# Altium schematic sheet Power Managemend and Connectors.SchDoc (part 1 of 2)
size A3; SheetNumber: 2; SheetTotal: 3; PageSize: A3; ProjectDescription: Power Managemend and Connectors; preparedBy: Semih AŞÇI; department: HW Design; RelaseDate: 22.12.2021; changedDate: 22.12.2021
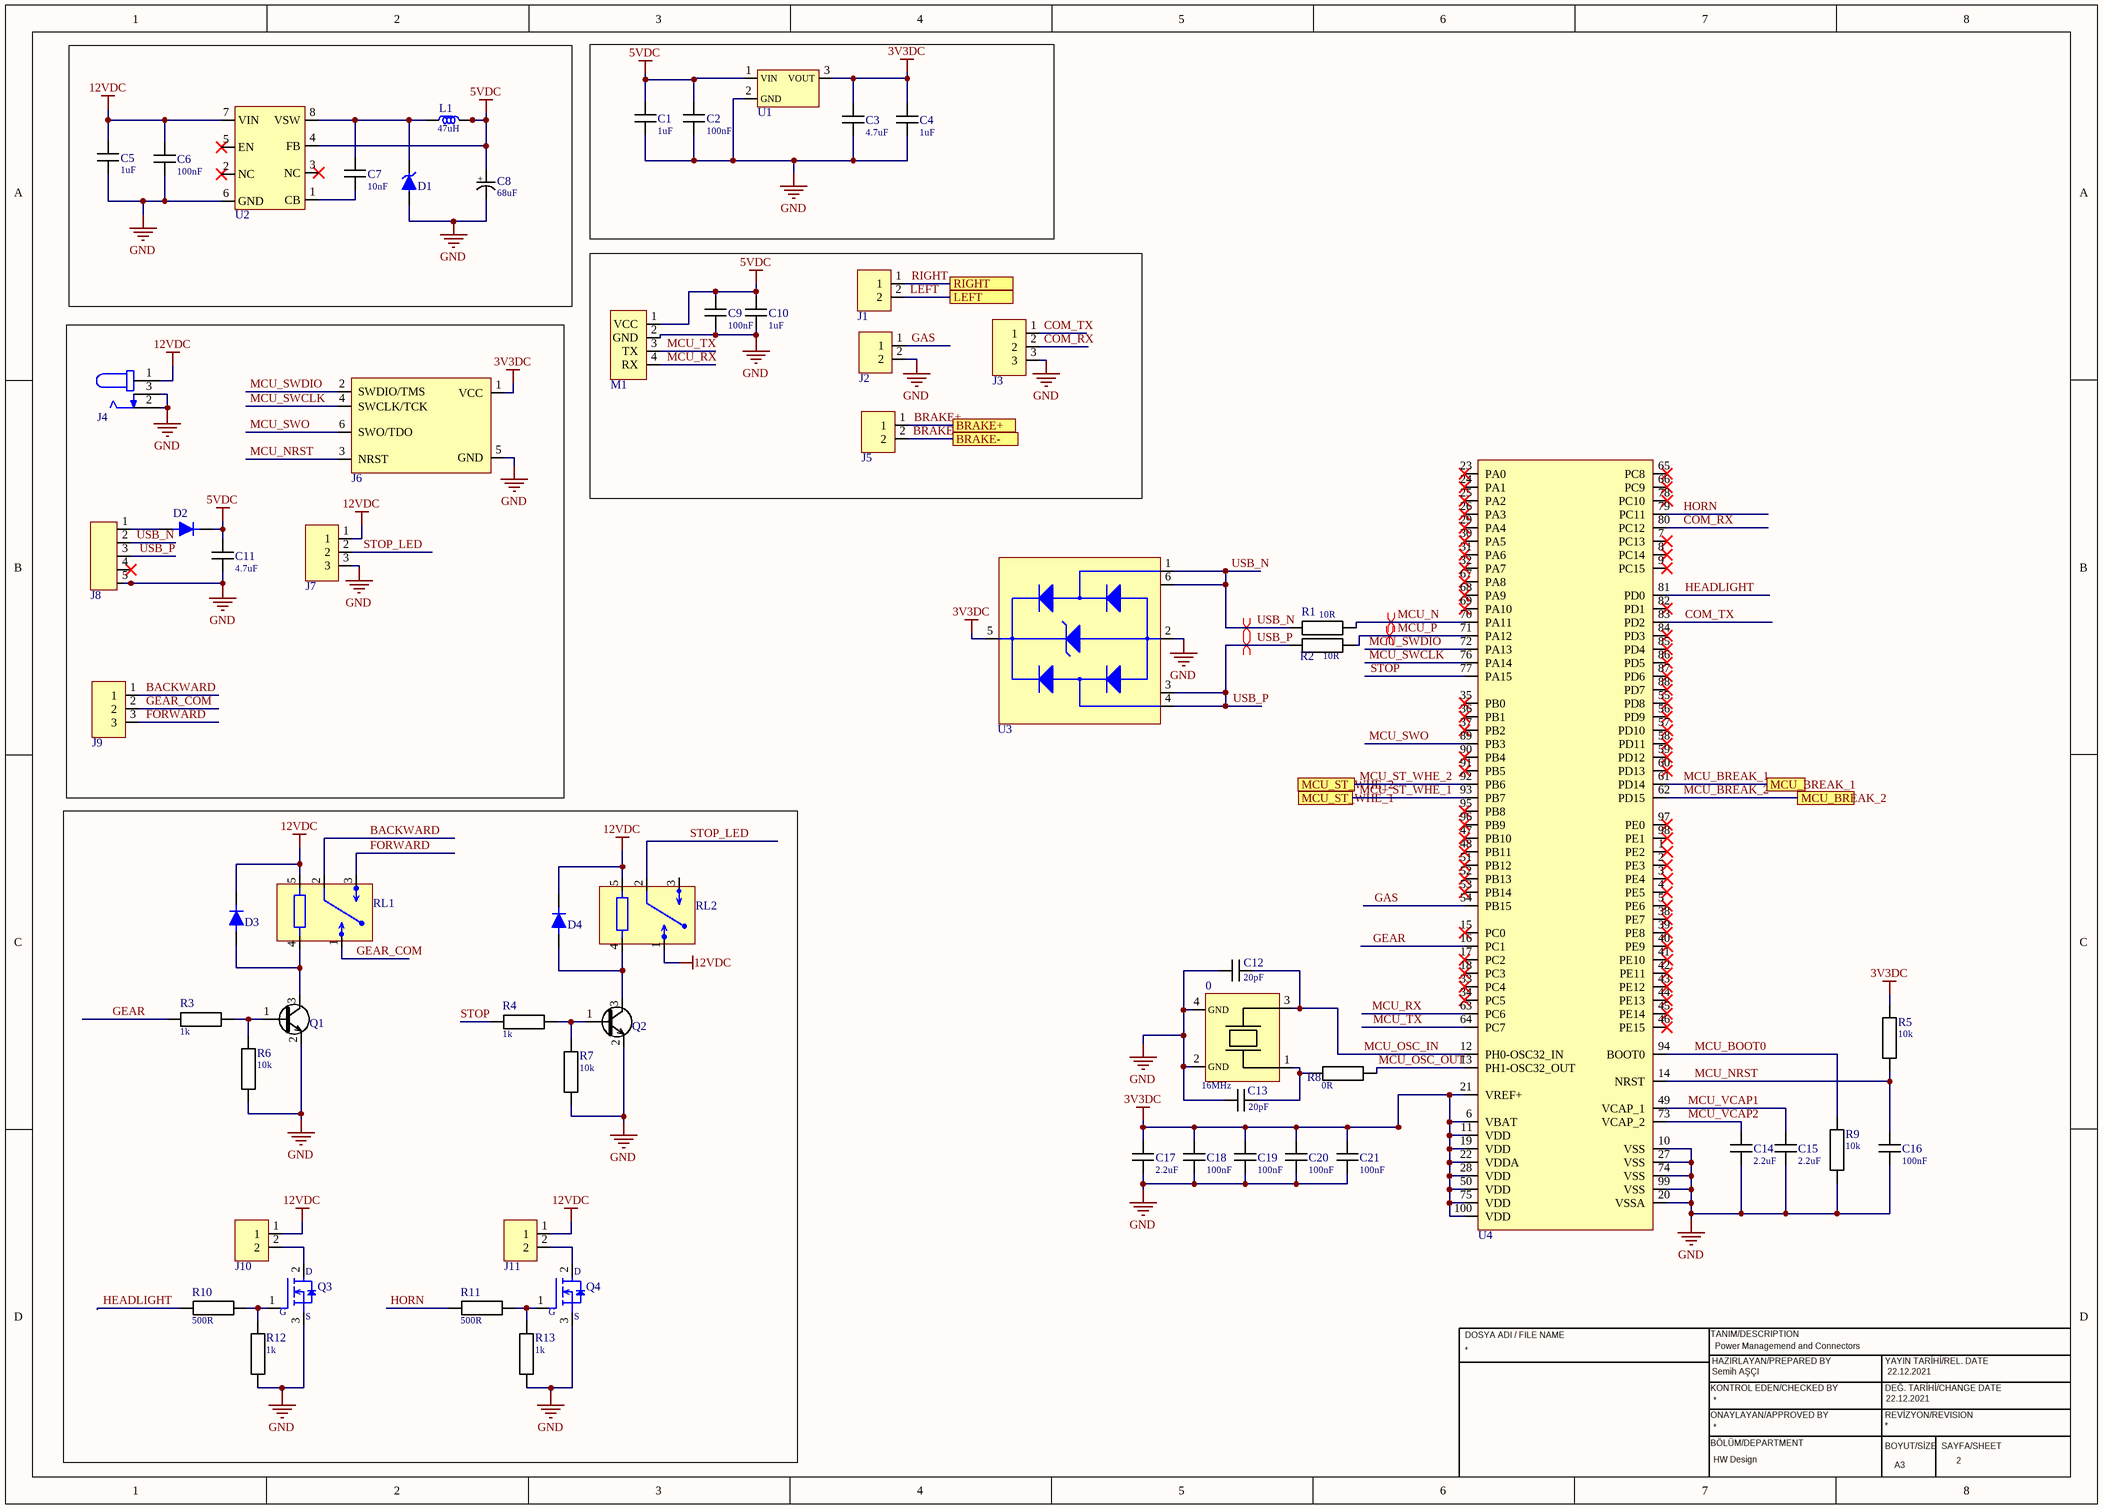
[diagram p0: Power Managemend and Connectors.SchDoc]

## Parts
0  Frequency: 16MHz  [ECS]  (hidden comment: ECS-160-20-30B-TR)
C1  Capacitance: 1uF  [CAP_0805]  (hidden comment: C0805C105M5RACTU)
C2  Capacitance: 100nF  [CAP_0805]  (hidden comment: C0805C104K5RAC7800)
C3  Capacitance: 4.7uF  [CAP_0805]  (hidden comment: CL21A475KAQNNNE)
C4  Capacitance: 1uF  [CAP_0805]  (hidden comment: C0805C105M5RACTU)
C5  Capacitance: 1uF  [CAP_0805]  (hidden comment: C0805C105M5RACTU)
C6  Capacitance: 100nF  [CAP_0805]  (hidden comment: C0805C104K5RAC7800)
C7  Capacitance: 10nF  [CAP_0603]  (hidden comment: 0603B103K160CT)
C8  Capacitance: 68uF  [CAP_ELEC_EEE-HA0J101WR]  (hidden comment: EEV686M035A9HAA)
C9  Capacitance: 100nF  [CAP_0805]  (hidden comment: C0805C104K5RAC7800)
C10  Capacitance: 1uF  [CAP_0805]  (hidden comment: C0805C105M5RACTU)
C11  Capacitance: 4.7uF  [CAP_0805]  (hidden comment: CL21A475KAQNNNE)
C12  Capacitance: 20pF  [CAP_0603]  (hidden comment: C0603C200F5GAC7867)
C13  Capacitance: 20pF  [CAP_0603]  (hidden comment: C0603C200F5GAC7867)
C14  Capacitance: 2.2uF  [CAP_1206]  (hidden comment: C1206C225K5RACAUTO)
C15  Capacitance: 2.2uF  [CAP_1206]  (hidden comment: C1206C225K5RACAUTO)
C16  Capacitance: 100nF  [CAP_0805]  (hidden comment: C0805C104K5RAC7800)
C17  Capacitance: 2.2uF  [CAP_1206]  (hidden comment: C1206C225K5RACAUTO)
C18  Capacitance: 100nF  [CAP_0805]  (hidden comment: C0805C104K5RAC7800)
C19  Capacitance: 100nF  [CAP_0805]  (hidden comment: C0805C104K5RAC7800)
C20  Capacitance: 100nF  [CAP_0805]  (hidden comment: C0805C104K5RAC7800)
C21  Capacitance: 100nF  [CAP_0805]  (hidden comment: C0805C104K5RAC7800)
D1  1SMB5919BT3G  [SMB]  (value not drawn)
D2  1N4148WS  [SOD323F]  (value not drawn)
D3  1N4148WS  [SOD323F]  (value not drawn)
D4  1N4148WS  [SOD323F]  (value not drawn)
J1  B2P-VH-BK  [2x1_HEADER]  (value not drawn)
J2  B2P-VH-BK  [2x1_HEADER]  (value not drawn)
J3  B3P-VH-BK  [3x1_HEADER]  (value not drawn)
J4  PJ-037AH-SMT-TR  [POWER_JACK]  (value not drawn)
J5  B2P-VH-BK  [2x1_HEADER]  (value not drawn)
J6  TC2030-STK  [TC2030]  (value not drawn)
J7  B3P-VH-BK  [3x1_HEADER]  (value not drawn)
J8  10118192-0001LF  [MICRO_B_USB]  (value not drawn)
J9  B3P-VH-BK  [3x1_HEADER]  (value not drawn)
J10  B2P-VH-BK  [2x1_HEADER]  (value not drawn)
J11  B2P-VH-BK  [2x1_HEADER]  (value not drawn)
L1  Inductance: 47uH  [IND_1212]  (hidden comment: 78438335470)
M1  HC06  [HC06]  (value not drawn)
Q1  MMBT3904-7-F  [SOT23-F]  (value not drawn)
Q2  MMBT3904-7-F  [SOT23-F]  (value not drawn)
Q3  IRF3710STRLPBF  [TO-263-3]  (value not drawn)
Q4  IRF3710STRLPBF  [TO-263-3]  (value not drawn)
R1  Resistance: 10R  [CAP_0805]  (hidden comment: RC0805FR-0710RL)
R2  Resistance: 10R  [CAP_0805]  (hidden comment: RC0805FR-0710RL)
R3  Resistance: 1k  [RES_0805]  (hidden comment: RC0805FR-071KL)
R4  Resistance: 1k  [RES_0805]  (hidden comment: RC0805FR-071KL)
R5  Resistance: 10k  [RES_0603]  (hidden comment: RC0603FR-0710KL)
R6  Resistance: 10k  [RES_0603]  (hidden comment: RC0603FR-0710KL)
R7  Resistance: 10k  [RES_0603]  (hidden comment: RC0603FR-0710KL)
R8  Resistance: 0R  [RES_0603]  (hidden comment: RC0603JR-070RL)
R9  Resistance: 10k  [RES_0603]  (hidden comment: RC0603FR-0710KL)
R10  Resistance: 500R  [RES_0805]  (hidden comment: PLT0805Z5000AST5)
R11  Resistance: 500R  [RES_0805]  (hidden comment: PLT0805Z5000AST5)
R12  Resistance: 1k  [RES_0805]  (hidden comment: RC0805FR-071KL)
R13  Resistance: 1k  [RES_0805]  (hidden comment: RC0805FR-071KL)
RL1  ALQ112  [ALQ112]  (value not drawn)
RL2  ALQ112  [ALQ112]  (value not drawn)
U1  AP7361-33E-13  [SOT223]  (value not drawn)
U2  LM2675MX-12/NOPB  [SOIC8]  (value not drawn)
U3  USBLC6_2SC6  [SOT23-6L]  (value not drawn)
U4  497-11605-ND  [100-LQFP]  (value not drawn)

## Ports
BRAKE+, BRAKE-, LEFT, MCU_BREAK_1, MCU_BREAK_2, MCU_ST_WHE_1, MCU_ST_WHE_2, RIGHT

## Nets
3V3DC: C3.2 C4.2 C17.2 C18.1 C19.1 C20.1 C21.1 J6.1(VCC) R5.2 U1.3(VOUT) U3.5(VBUS) U4.6(VBAT) U4.11(VDD) U4.19(VDD) U4.21(VREF+) U4.22(VDDA) U4.28(VDD) U4.50(VDD) U4.75(VDD) U4.100(VDD)
5VDC: C1.2 C2.2 C8.1 C9.2 C10.2 C11.2 D2.1 L1.2 M1.1(VCC) U1.1(VIN) U2.4(FB)
12VDC: C5.2 C6.2 D3.1 D4.1 J4.1(Vcc) J7.1 J10.1 J11.1 RL1.5 RL2.1 RL2.5 U2.7(VIN)
GND: 0.2(GND) 0.4(GND) C1.1 C2.1 C3.1 C4.1 C5.1 C6.1 C8.2 C9.1 C10.1 C11.1 C12.1 C13.1 C14.1 C15.1 C16.2 C17.1 C18.2 C19.2 C20.2 C21.2 D1.1 J2.2 J3.3 J4.2(GND) J4.3(SH) J6.5(GND) J7.3 J8.5(GND) M1.2(GND) Q1.2(E) Q2.2(E) Q3.3(D) Q4.3(D) R6.1 R7.1 R9.1 R12.1 R13.1 U1.2(GND) U2.6(GND) U3.2(GND) U4.10(VSS) U4.20(VSSA) U4.27(VSS) U4.74(VSS) U4.99(VSS)
BACKWARD: J9.1 RL1.2
BRAKE+: J5.1 ; port BRAKE+
BRAKE-: J5.2 ; port BRAKE-
COM_RX: J3.2 U4.80(PC12)
COM_TX: J3.1 U4.83(PD2)
FORWARD: J9.3 RL1.3
GAS: J2.1 U4.54(PB15)
GEAR: R3.1 U4.16(PC1)
GEAR_COM: J9.2 RL1.1
HEADLIGHT: R10.1 U4.81(PD0)
HORN: R11.1 U4.79(PC11)
LEFT: J1.2 ; port LEFT
MCU_BOOT0: R9.2 U4.94(BOOT0)
MCU_BREAK_1: U4.61(PD14) ; port MCU_BREAK_1
MCU_BREAK_2: U4.62(PD15) ; port MCU_BREAK_2
MCU_N: R1.2 U4.70(PA11)
MCU_NRST: C16.1 J6.3(NRST) R5.1 U4.14(NRST)
MCU_OSC_IN: 0.3 C12.2 U4.12(PH0-OSC32_IN)
MCU_OSC_OUT: R8.2 U4.13(PH1-OSC32_OUT)
MCU_P: R2.2 U4.71(PA12)
MCU_RX: M1.4(RX) U4.63(PC6)
MCU_ST_WHE_1: U4.93(PB7) ; port MCU_ST_WHE_1
MCU_ST_WHE_2: U4.92(PB6) ; port MCU_ST_WHE_2
MCU_SWCLK: J6.4(SWCLK/TCK) U4.76(PA14)
MCU_SWDIO: J6.2(SWDIO/TMS) U4.72(PA13)
MCU_SWO: J6.6(SWO/TDO) U4.89(PB3)
MCU_TX: M1.3(TX) U4.64(PC7)
MCU_VCAP1: C15.2 U4.49(VCAP_1)
MCU_VCAP2: C14.2 U4.73(VCAP_2)
RIGHT: J1.1 ; port RIGHT
STOP: R4.1 U4.77(PA15)
STOP_LED: J7.2 RL2.2
USB_N: J8.2(Rx) R1.1 U3.1(I/O1) U3.6(I/O1)
USB_P: J8.3(Tx) R2.1 U3.3(I/O2) U3.4(I/O2)
Net0_1: 0.1 C13.2 R8.1
NetC7_1: C7.1 U2.1(CB)
NetC7_2: C7.2 D1.2 L1.1 U2.8(VSW)
NetD2_2: D2.2 J8.1(Vcc)
NetD3_2: D3.2 Q1.3(C) RL1.4
NetD4_2: D4.2 Q2.3(C) RL2.4
NetJ10_2: J10.2 Q3.2(G)
NetJ11_2: J11.2 Q4.2(G)
NetQ1_1: Q1.1(B) R3.2 R6.2
NetQ2_1: Q2.1(B) R4.2 R7.2
NetQ3_1: Q3.1(S) R10.2 R12.2
NetQ4_1: Q4.1(S) R11.2 R13.2

Not connected (* = marked no-connect by the designer): J8 4(NC)*; RL2 3; U2 2(NC)* 3(NC)* 5(EN)*; U4 1(PE2)* 2(PE3)* 3(PE4)* 4(PE5)* 5(PE6)* 7(PC13)* 8(PC14)* 9(PC15)* 15(PC0)* 17(PC2)* 18(PC3)* 23(PA0)* 24(PA1)* 25(PA2)* 26(PA3)* 29(PA4)* 30(PA5)* 31(PA6)* 32(PA7)* 33(PC4)* 34(PC5)* 35(PB0)* 36(PB1)* 37(PB2)* 38(PE7)* 39(PE8)* 40(PE9)* 41(PE10)* 42(PE11)* 43(PE12)* 44(PE13)* 45(PE14)* 46(PE15)* 47(PB10)* 48(PB11)* 51(PB12)* 52(PB13)* 53(PB14)* 55(PD8)* 56(PD9)* 57(PD10)* 58(PD11)* 59(PD12)* 60(PD13)* 65(PC8)* 66(PC9)* 67(PA8)* 68(PA9)* 69(PA10)* 78(PC10)* 82(PD1)* 84(PD3)* 85(PD4)* 86(PD5)* 87(PD6)* 88(PD7)* 90(PB4)* 91(PB5)* 95(PB8)* 96(PB9)* 97(PE0)* 98(PE1)*

## Layout directives
differential pair: MCU_N, MCU_P, USB_N, USB_P

## Notes on the sheet
- 12VDC convert to 5VDC
- 5VDC convert to 3.3VDC
- DOSYA ADI / FILE NAME
- TANIM/DESCRIPTION
- KONTROL EDEN/CHECKED BY
- HAZIRLAYAN/PREPARED BY
- DEĞ. TARİHİ/CHANGE DATE
- YAYIN TARİHİ/REL. DATE
- ONAYLAYAN/APPROVED BY
- BÖLÜM/DEPARTMENT
- BOYUT/SİZE
- REVİZYON/REVISION
- SAYFA/SHEET
- (in symbol CAP 68uF Polar SMD) +